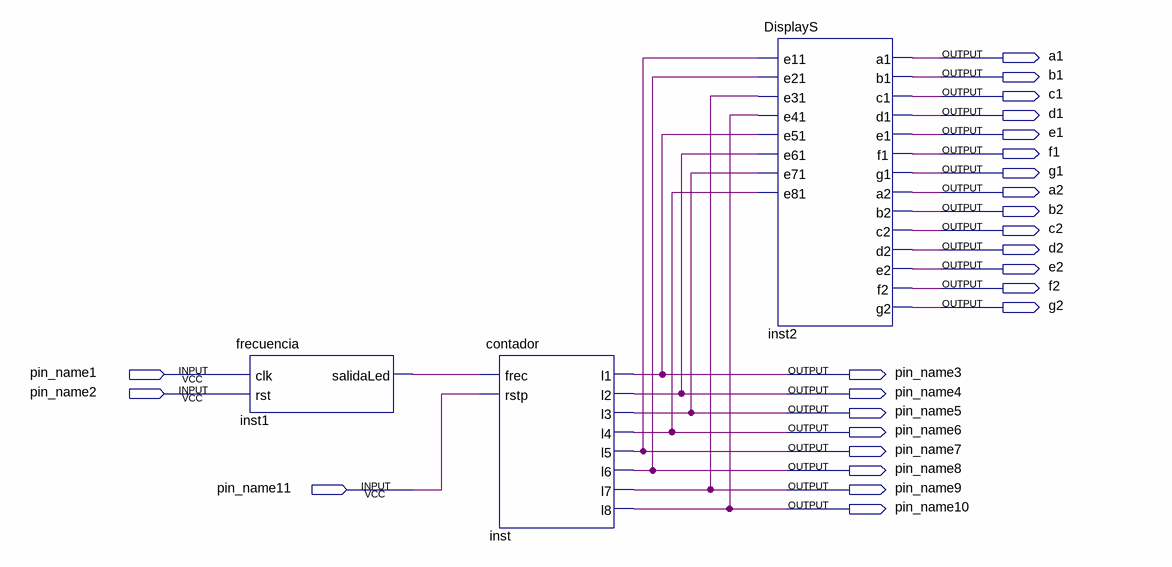
[diagram p0: schematic sheet]
// Quartus schematic practica4.bdf as structural Verilog: 3 symbols, 25 pins
module practica4 (
  input  pin_name1,
  input  pin_name2,
  input  pin_name11,
  output a1,
  output b1,
  output c1,
  output d1,
  output e1,
  output f1,
  output g1,
  output a2,
  output b2,
  output c2,
  output d2,
  output e2,
  output f2,
  output g2,
  output pin_name3,
  output pin_name4,
  output pin_name5,
  output pin_name6,
  output pin_name7,
  output pin_name8,
  output pin_name9,
  output pin_name10
);

  wire inst1_salidaled;

  frecuencia inst1 (.clk(pin_name1), .rst(pin_name2), .salidaLed(inst1_salidaled));
  contador inst (
    .frec(inst1_salidaled), .rstp(pin_name11), .l1(pin_name3), .l2(pin_name4), .l3(pin_name5),
    .l4(pin_name6), .l5(pin_name7), .l6(pin_name8), .l7(pin_name9), .l8(pin_name10));
  DisplayS inst2 (
    .e11(pin_name7), .e21(pin_name8), .e31(pin_name9), .e41(pin_name10), .e51(pin_name3), .e61(pin_name4),
    .e71(pin_name5), .e81(pin_name6), .a1(a1), .b1(b1), .c1(c1), .d1(d1), .e1(e1), .f1(f1), .g1(g1), .a2(a2),
    .b2(b2), .c2(c2), .d2(d2), .e2(e2), .f2(f2), .g2(g2));
endmodule
